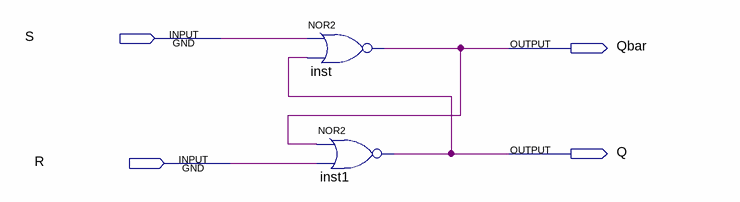
[diagram p0: schematic sheet]
// Quartus schematic SR_Latch.bdf as structural Verilog: 2 symbols, 4 pins
module SR_Latch (
  input  S,
  input  R,
  output Qbar,
  output Q
);

  nor inst (Qbar, S, Q);
  nor inst1 (Q, Qbar, R);
endmodule
